# Altium schematic sheet GSM IoT.SchDoc: GSM IoT Block Diagram
size A3; DocumentNumber: 8; SheetNumber: 8; SheetTotal: 54
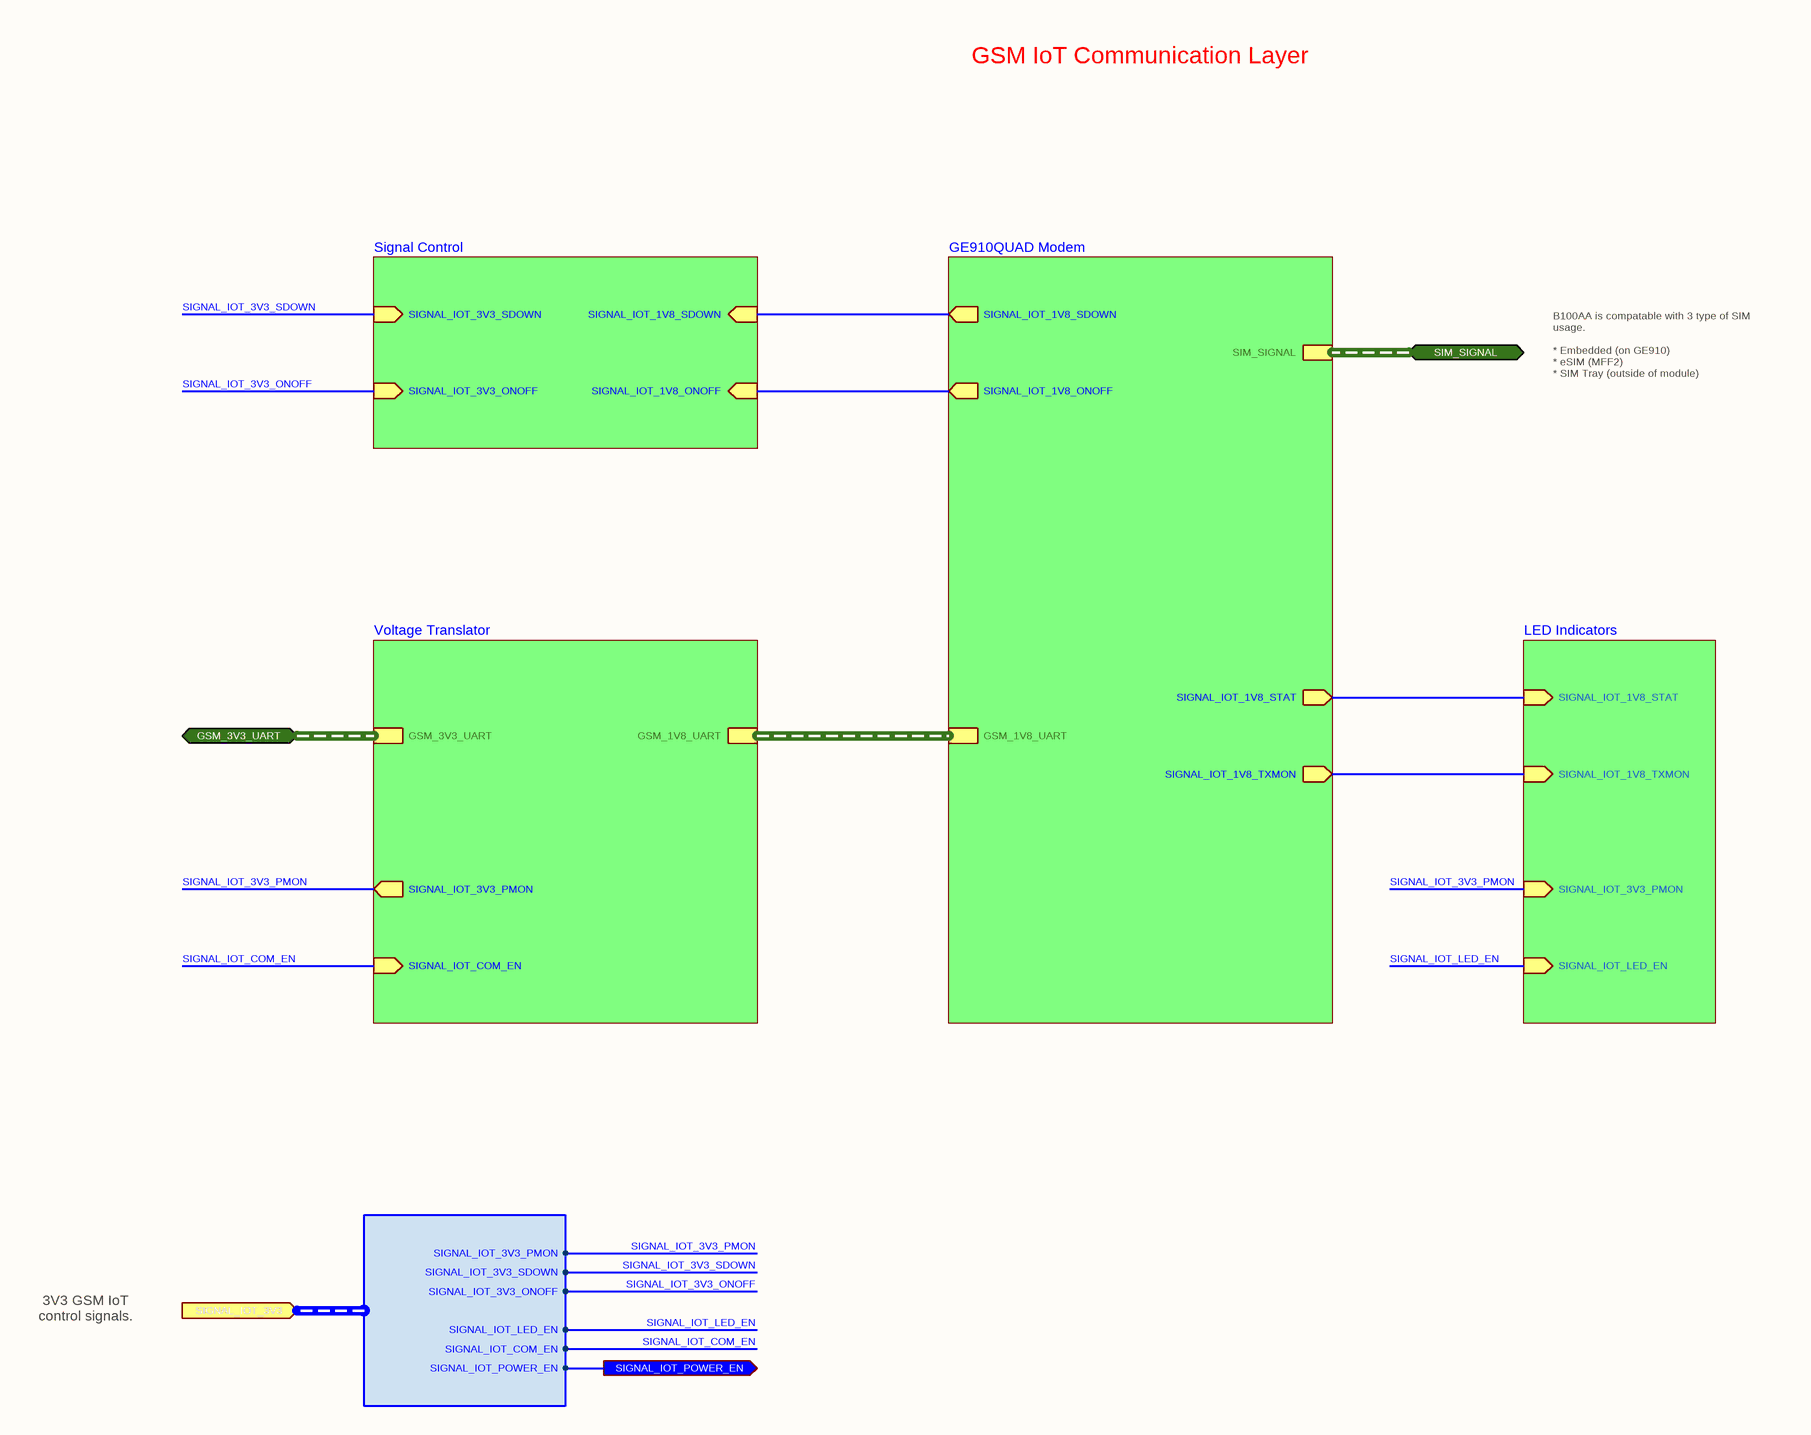
[diagram p0: GSM IoT.SchDoc]

## Sub-sheets
GE910QUAD Modem = GE910QUAD Modem.SchDoc: SIGNAL_IOT_1V8_STAT (out), SIGNAL_IOT_1V8_TXMON (out), SIGNAL_IOT_1V8_ONOFF (out), GSM_1V8_UART (harness GSM_1V8_UART), SIGNAL_IOT_1V8_SDOWN (out), SIM_SIGNAL (harness SIM_SIGNAL)
LED Indicators = GSM LED Indicators.SchDoc: SIGNAL_IOT_3V3_PMON (in), SIGNAL_IOT_1V8_STAT (in), SIGNAL_IOT_LED_EN (in), SIGNAL_IOT_1V8_TXMON (in)
Signal Control = GSM Signal Control.SchDoc: SIGNAL_IOT_3V3_SDOWN (in), SIGNAL_IOT_3V3_ONOFF (in), SIGNAL_IOT_1V8_SDOWN (in), SIGNAL_IOT_1V8_ONOFF (in)
Voltage Translator = Bidirectional Voltage Translator.SchDoc: GSM_3V3_UART (harness GSM_3V3_UART), SIGNAL_IOT_COM_EN (in), GSM_1V8_UART (harness GSM_1V8_UART), SIGNAL_IOT_3V3_PMON (out)

## Ports
GSM_3V3_UART (bidir, harness GSM_3V3_UART), SIGNAL_IOT_3V3 (in, harness SIGNAL_IOT_3V3), SIGNAL_IOT_POWER_EN (out), SIM_SIGNAL (bidir, harness SIM_SIGNAL)

## Harnesses
SIGNAL_IOT_3V3: SIGNAL_IOT_COM_EN, SIGNAL_IOT_POWER_EN, SIGNAL_IOT_LED_EN, SIGNAL_IOT_3V3_SDOWN, SIGNAL_IOT_3V3_ONOFF, SIGNAL_IOT_3V3_PMON

## Nets
SIGNAL_IOT_3V3_ONOFF: sheet Signal Control/SIGNAL_IOT_3V3_ONOFF, port SIGNAL_IOT_3V3.SIGNAL_IOT_3V3_ONOFF
SIGNAL_IOT_3V3_PMON: sheet Voltage Translator/SIGNAL_IOT_3V3_PMON, sheet LED Indicators/SIGNAL_IOT_3V3_PMON, port SIGNAL_IOT_3V3.SIGNAL_IOT_3V3_PMON
SIGNAL_IOT_3V3_SDOWN: sheet Signal Control/SIGNAL_IOT_3V3_SDOWN, port SIGNAL_IOT_3V3.SIGNAL_IOT_3V3_SDOWN
SIGNAL_IOT_COM_EN: sheet Voltage Translator/SIGNAL_IOT_COM_EN, port SIGNAL_IOT_3V3.SIGNAL_IOT_COM_EN
SIGNAL_IOT_LED_EN: sheet LED Indicators/SIGNAL_IOT_LED_EN, port SIGNAL_IOT_3V3.SIGNAL_IOT_LED_EN
SIGNAL_IOT_POWER_EN: port SIGNAL_IOT_POWER_EN, port SIGNAL_IOT_3V3.SIGNAL_IOT_POWER_EN
(unnamed): sheet GE910QUAD Modem/SIGNAL_IOT_1V8_STAT, sheet LED Indicators/SIGNAL_IOT_1V8_STAT
(unnamed): sheet GE910QUAD Modem/SIGNAL_IOT_1V8_TXMON, sheet LED Indicators/SIGNAL_IOT_1V8_TXMON
(unnamed): sheet GE910QUAD Modem/SIGNAL_IOT_1V8_ONOFF, sheet Signal Control/SIGNAL_IOT_1V8_ONOFF
(unnamed): sheet GE910QUAD Modem/SIGNAL_IOT_1V8_SDOWN, sheet Signal Control/SIGNAL_IOT_1V8_SDOWN

## Buses and harness runs
harness port GSM_3V3_UART = sheet Voltage Translator/GSM_3V3_UART
harness port SIM_SIGNAL = sheet GE910QUAD Modem/SIM_SIGNAL
harness sheet GE910QUAD Modem/GSM_1V8_UART = sheet Voltage Translator/GSM_1V8_UART

## Notes on the sheet
- GSM IoT Communication Layer
- B100AA is compatable with 3 type of SIM usage.
  * Embedded (on GE910)
  * eSIM (MFF2)
  * SIM Tray (outside of module)
  One of these SIM type is used.
- 3V3 GSM IoT control signals.
- Title
- Size:
- Date:
- A3
- Number:
- Time:
- Revision:
- Sheet
- of
- File: